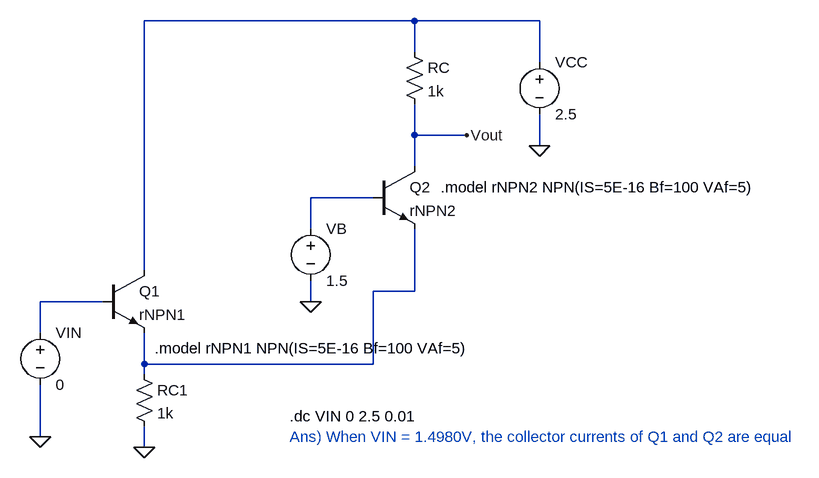
[diagram p0: schematic 4_61.asc]
4_61.asc, the LTspice schematic file:
Version 4
SHEET 1 880 680
WIRE 144 -96 -272 -96
WIRE 336 -96 144 -96
WIRE 144 -48 144 -96
WIRE 336 -32 336 -96
WIRE 144 80 144 32
WIRE 224 80 144 80
WIRE 336 96 336 48
WIRE 144 128 144 80
WIRE 80 176 -16 176
WIRE -16 224 -16 176
WIRE -272 288 -272 -96
WIRE 144 320 144 224
WIRE 144 320 80 320
WIRE -336 336 -432 336
WIRE -16 336 -16 304
WIRE -432 384 -432 336
WIRE -272 432 -272 384
WIRE 80 432 80 320
WIRE 80 432 -272 432
WIRE -272 448 -272 432
WIRE -432 544 -432 464
WIRE -272 560 -272 528
FLAG -16 336 0
FLAG 336 96 0
FLAG 224 80 Vout
FLAG -272 560 0
FLAG -432 544 0
SYMBOL npn 80 128 R0
SYMATTR InstName Q2
SYMATTR Value rNPN2
SYMBOL voltage -16 208 R0
SYMATTR InstName VB
SYMATTR Value 1.5
SYMBOL voltage 336 -48 R0
SYMATTR InstName VCC
SYMATTR Value 2.5
SYMBOL res 128 -64 R0
SYMATTR InstName RC
SYMATTR Value 1k
SYMBOL npn -336 288 R0
SYMATTR InstName Q1
SYMATTR Value rNPN1
SYMBOL res -288 432 R0
SYMATTR InstName RC1
SYMATTR Value 1k
SYMBOL voltage -432 368 R0
SYMATTR InstName VIN
SYMATTR Value 0
TEXT 184 160 Left 2 !.model rNPN2 NPN(IS=5E-16 Bf=100 VAf=5)
TEXT -48 544 Left 2 ;Ans) When VIN = 1.4980V, the collector currents of Q1 and Q2 are equal
TEXT -48 512 Left 2 !.dc VIN 0 2.5 0.01
TEXT -256 408 Left 2 !.model rNPN1 NPN(IS=5E-16 Bf=100 VAf=5)

The netlist it stands for:
* 4_61.asc
Q2 Vout N002 N003 0 rNPN2
VB N002 0 1.5
VCC N001 0 2.5
RC N001 Vout 1k
Q1 N001 N004 N003 0 rNPN1
RC1 N003 0 1k
VIN N004 0 0
.model NPN NPN
.model PNP PNP
.lib standard.bjt
.model rNPN2 NPN(IS=5E-16 Bf=100 VAf=5)
* Ans) When VIN = 1.4980V, the collector currents of Q1 and Q2 are equal
.dc VIN 0 2.5 0.01
.model rNPN1 NPN(IS=5E-16 Bf=100 VAf=5)
.backanno
.end

* Results of the author's LTspice run, read from the files saved beside the schematic
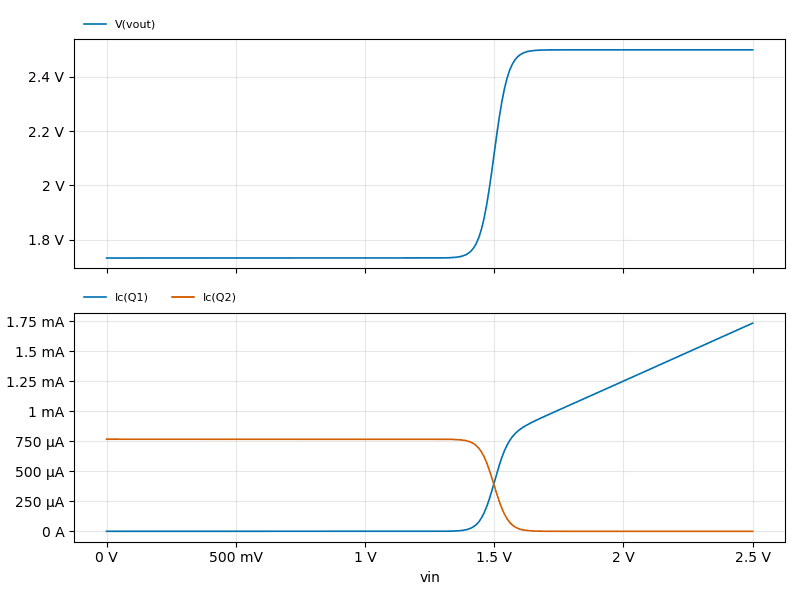
[diagram p1: DC transfer characteristic of 4_61.asc, plotted from the saved traces]
* DC transfer characteristic, 1 run:
*   V(vout): 1.732 V at vin=0 V, 2.5 V at vin=2.5 V, min 1.732 V, max 2.5 V
*   Ic(Q1): 2.501 pA at vin=0 V, 1.736 mA at vin=2.5 V, min 1.656 pA, max 1.736 mA
*   Ic(Q2): 768.1 µA at vin=0 V, 1.001 pA at vin=2.5 V, min 1.001 pA, max 768.1 µA